# EAGLE design pyIMU (EAGLE 6.6.0)
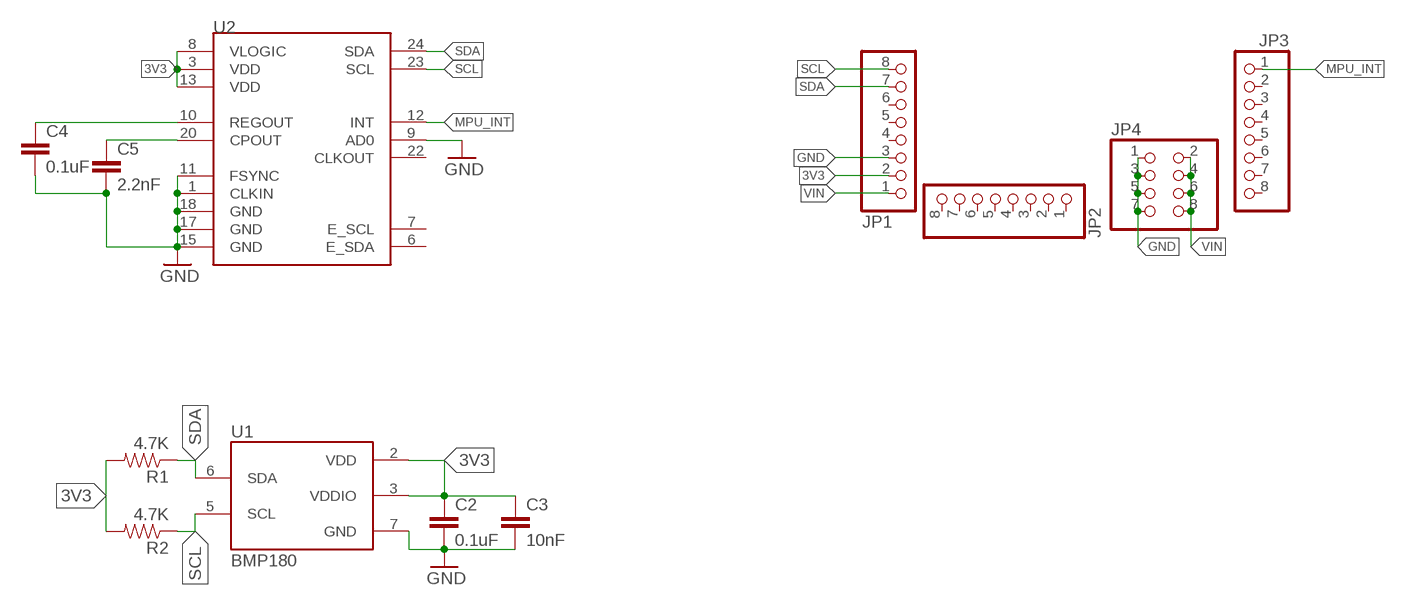
[diagram p0: schematic, sheet 1]

## Parts
C2  0.1uF  0.1UF-25V(+80/-20%)(0603)  [0603-CAP]
C3  10nF  10NF/10000PF-50V-10%(0603)  [0603-CAP]
C4  0.1uF  0.1UF-25V(+80/-20%)(0603)  [0603-CAP]
C5  2.2nF  2.2NF/2200PF-50V-10%(0603)  [0603-CAP]
JP1  PINHD-1X8  [1X08]
JP2  PINHD-1X8  [1X08]
JP3  PINHD-1X8  [1X08]
JP4  PINHD-2X4  [2X04]
R1  4.7K  4.7KOHM1/10W1%(0603)  [0603-RES]
R2  4.7K  4.7KOHM1/10W1%(0603)  [0603-RES]
U1  BMP180  [BMP180]
U2  MPU-9150QFN-24-NP  [QFN-24-NP]

## Nets
3V3: C2.1 C3.1 JP1.2 R1.2 R2.2 U1.2(VDD) U1.3(VDDIO) U2.3(VDD) U2.8(VLOGIC) U2.13(VDD)
GND: C2.2 C3.2 C4.2 C5.2 JP1.3 JP4.1 JP4.3 JP4.5 JP4.7 U1.7(GND) U2.1(CLKIN) U2.9(AD0) U2.11(FSYNC) U2.15(GND) U2.17(GND) U2.18(GND)
MPU_INT: JP3.1 U2.12(INT)
N$1: C4.1 U2.10(REGOUT)
N$2: C5.1 U2.20(CPOUT)
SCL: JP1.8 R2.1 U1.5(SCL) U2.23(SCL)
SDA: JP1.7 R1.1 U1.6(SDA) U2.24(SDA)
VIN: JP1.1 JP4.2 JP4.4 JP4.6 JP4.8
Unconnected: JP1.4 JP1.5 JP1.6 JP2.1 JP2.2 JP2.3 JP2.4 JP2.5 JP2.6 JP2.7 JP2.8 JP3.2 JP3.3 JP3.4 JP3.5 JP3.6 JP3.7 JP3.8 U2.6(E_SDA) U2.7(E_SCL) U2.22(CLKOUT)

## Library data of the parts
C2 C4 = SparkFun-Capacitors:0.1UF-25V(+80/-20%)(0603): CAP-00810 Ceramic Standard decoupling cap; PROD_ID: CAP-00810
C3 = SparkFun-Capacitors:10NF/10000PF-50V-10%(0603): CAP-00867; PROD_ID: CAP-00867
C5 = SparkFun-Capacitors:2.2NF/2200PF-50V-10%(0603): CAP-07877; PROD_ID: CAP-07877
JP1-JP3 = pinhead:PINHD-1X8: PIN HEADER
JP4 = pinhead:PINHD-2X4: PIN HEADER
R1 R2 = SparkFun-Resistors:4.7KOHM1/10W1%(0603): RES-07857; PROD_ID: RES-07857
U1 = SparkFun-Sensors:BMP180: BOSCH BMP180 DIGITAL BAROMETRIC PRESSURE SENSOR Web page: http://www.bosch-sensortec.com/en/homepage/products_3/environmental_sensors_1/bmp180_1/bmp180 Datasheet: http://ae-bst.resource.bosch.com/media/products/dokumente/bmp180/BST-BMP180-DS000-09.pdf The BMP180 is the function compatible successor of the BMP085, a new generation of high precision digital pressure sensors for consumer applications. The ultra-low power, low voltage electronics of the BMP180 is optimized for use in mobile phones, PDAs, GPS navigation devices and outdoor equipment. With a low altitude noise of merely 0.25m at fast conversion time, the BMP180 offers superior performance. The I2C interface allows for easy system integration with a microcontroller. The BMP180 is based on piezo-resistive technology for EMC robustness, high accuracy and linearity as well as long term stability. Key features: - Temperature measurement included - I2C interface - Fully calibrated - Pb-free, halogen-free and RoHS compliant, - MSL 1 Basic specs: Pressure range: 300 to 1100hPa (+9000m to -500m relating to sea level) Supply voltage: 1.8 to 3.6V (VDD), 1.62V to 3.6V (VDDIO) Package: LGA package with metal lid Small footprint: 3.6mm x 3.8mm Super-flat: 0.93mm height Low power: 5μA at 1 sample / sec. in standard mode Low noise: 0.06hPa (0.5m) in ultra low power mode, 0.02hPa (0.17m) advanced resolution mode Typical applications: - Enhancement of GPS navigation (dead-reckoning, slope detection, etc.) - In- and out-door navigation - Leisure and sports - Weather forecast - Vertical velocity indication (rise/sink speed)
U2 = SparkFun-Sensors:MPU-9150: 9DOF (3mag, 3accel, 3rotat). I2C interface.

## Net classes
0 default: clearance 0.205 mm

## Board
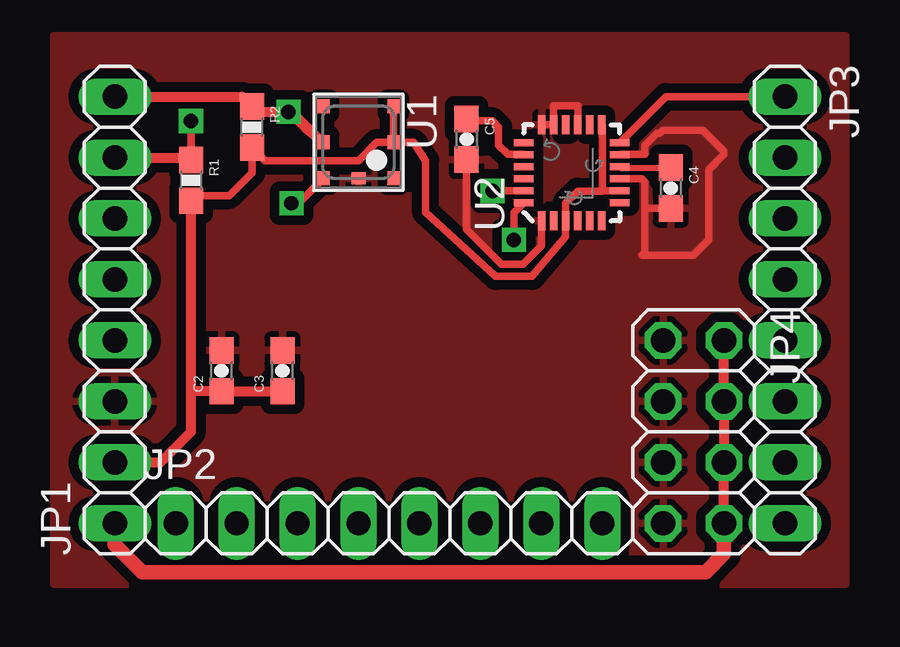
[diagram p1: board, top side]
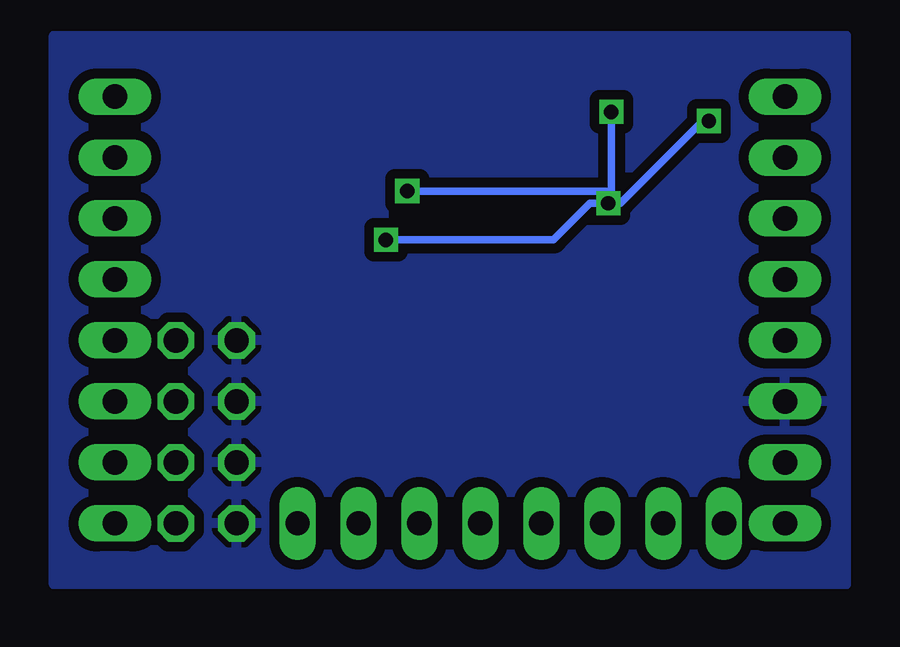
[diagram p2: board, bottom side, seen from below]

No outline drawn. Coordinates in mm, seen from the top.
Copper layers (1*16): Top 0.035mm / dielectric 1.5mm / Bottom 0.035mm
Design rules "default": minimum track width 10mil, minimum drill 24mil, track to track 8mil, track to pad 8mil, pad to pad 8mil, via to via 8mil, smd to smd 8mil, copper to edge 40mil, drill to drill 8mil, minimum pad ring 10mil, minimum via ring 8mil, stop-mask expansion 4mil, vias tented up to drill 0mil, thermal gap 10mil

### Footprints (pad centres in the part's own frame; a part is rotated, then mirrored left to right if it is on the bottom)
0603-CAP = smd 1.1 x 1: 1 -0.85,0; 2 0.85,0
1X08 = drill 1.016 long: 1 -8.89,0; 2 -6.35,0; 3 -3.81,0; 4 -1.27,0; 5 1.27,0; 6 3.81,0; 7 6.35,0; 8 8.89,0
2X04 = drill 1.016 octagon: 1 -3.81,-1.27; 2 -3.81,1.27; 3 -1.27,-1.27; 4 -1.27,1.27; 5 1.27,-1.27; 6 1.27,1.27; 7 3.81,-1.27; 8 3.81,1.27
0603-RES = smd 1.1 x 1: 1 -0.85,0; 2 0.85,0
BMP180 = smd 0.6 x 0.5: 1 1.5,1.45; 2 0,1.45; 3 -1.5,1.45; 4 -1.5,-1.45; 5 0,-1.45; 6 1.5,-1.45 | smd 0.5 x 0.6: 7 1.5,0
QFN-24-NP = smd 0.8 x 0.3: 1 -2,1.25; 2 -2,0.75; 3 -2,0.25; 4 -2,-0.25; 5 -2,-0.75; 6 -2,-1.25; 13 2,-1.25; 14 2,-0.75; 15 2,-0.25; 16 2,0.25; 17 2,0.75; 18 2,1.25 | smd 0.3 x 0.8: 7 -1.25,-2; 8 -0.75,-2; 9 -0.25,-2; 10 0.25,-2; 11 0.75,-2; 12 1.25,-2; 19 1.25,2; 20 0.75,2; 21 0.25,2; 22 -0.25,2; 23 -0.75,2; 24 -1.25,2

### Placement (x,y rotation side)
C2  6.99,8.89 90 top
C3  9.53,8.89 90 top
C4  25.72,16.51 270 top
C5  17.21,18.54 270 top
JP1  2.54,11.43 90 top
JP2  13.97,2.54 0 top
JP3  30.48,11.43 270 top
JP4  26.67,6.35 270 top
R1  5.71,16.83 270 top
R2  8.26,19.05 270 top
U1  12.7,18.41 270 top
U2  21.59,17.14 90 top

### Tracks (layer width: path | path; a pad name or v marks a point on that pad's centre or on a via)
3V3
  Top 0.305: R1.2 5.93,16.19 7.3,16.19 8.26,17.14 R2.2 8.8,17.65 12.7,17.65 13.46,18.41 U1.2 | U2.13 22.86,19.12 22.86,16.38 | 22.86,16.38 22.87,16.39 U2.8 | U2.3 | U2.3 21.34,15.88 21.84,16.38 22.86,16.38 | U2.3 21.34,14.48 19.94,12.83 18.41,12.83 15.49,15.49 15.49,17.65 14.99,18.41 U1.2 | U1.2 U1.3
  Top 0.406: C3.1 C2.1 5.82,8.04 5.71,7.94 | JP1.2 4.45,5.08 5.71,6.35 5.71,7.94 | 5.71,7.94 R1.2
GND
  Top 0.305: U2.18 U2.17 20.83,19.16 20.83,19.94 21.84,19.94 21.84,19.93 U2.15 | U2.9 24.51,16.89 24.64,16.76 24.64,15.62 | 24.64,15.62 24.68,15.66 C4.2 | U2.11 23.6,17.91 24.64,17.91 24.64,18.29 25.15,18.8 25.27,18.8 25.4,18.92 27.05,18.92 27.94,18.03 27.94,17.91 27.3,17.27 27.3,14.35 26.67,13.72 24.51,13.72 24.64,13.84 24.64,15.62 | U2.1 20.32,15.12 20.32,14.1 19.56,13.34 18.67,13.34 17.21,14.8 C5.2
  pour Top (isolate 0.406): 0,0 33.02,0 33.02,22.86 0,22.86 0,2.54
  pour Bottom (isolate 0.406): 0,0 33.02,0 33.02,22.86 0,22.86
MPU_INT
  Top 0.305: U2.12 25.52,20.32 JP3.1
N$1
  Top 0.254: U2.10 23.62,17.36 C4.1
N$2
  Top 0.305: U2.20 19.59,17.91 18.92,17.91 18.54,18.29 18.54,19.05 18.29,19.3 17.3,19.3 C5.1
SCL  (via drill 0.6)
  Top 0.305: U1.5 9.98,19.68 v9.78,19.68 | v18.29,16.38 18.29,16.39 U2.23
  Top 0.406: JP1.8 7.83,20.32 R2.1 8.47,19.68 v9.78,19.68 9.84,19.68 10.48,19.05 U1.5
  Bottom 0.305: v9.78,19.68 9.78,16.38 v18.29,16.38
SDA  (via drill 0.6)
  Top 0.305: U1.6 10.21,15.88 v9.91,15.88 | v5.71,19.3 R1.1 | U2.24 19.18,15.48 v19.18,14.35
  Top 0.406: JP1.7 5.61,17.78 R1.1
  Bottom 0.305: v5.71,19.3 5.97,19.3 9.4,15.88 v9.91,15.88 10.67,15.88 12.19,14.35 v19.18,14.35
VIN
  Top 0.406: JP4.8 JP4.6 JP4.4 JP4.2
  Top 0.61: JP1.1 2.54,1.65 3.68,0.51 27.18,0.51 27.94,1.27 JP4.8